# Altium project EPF-100.PrjPcb
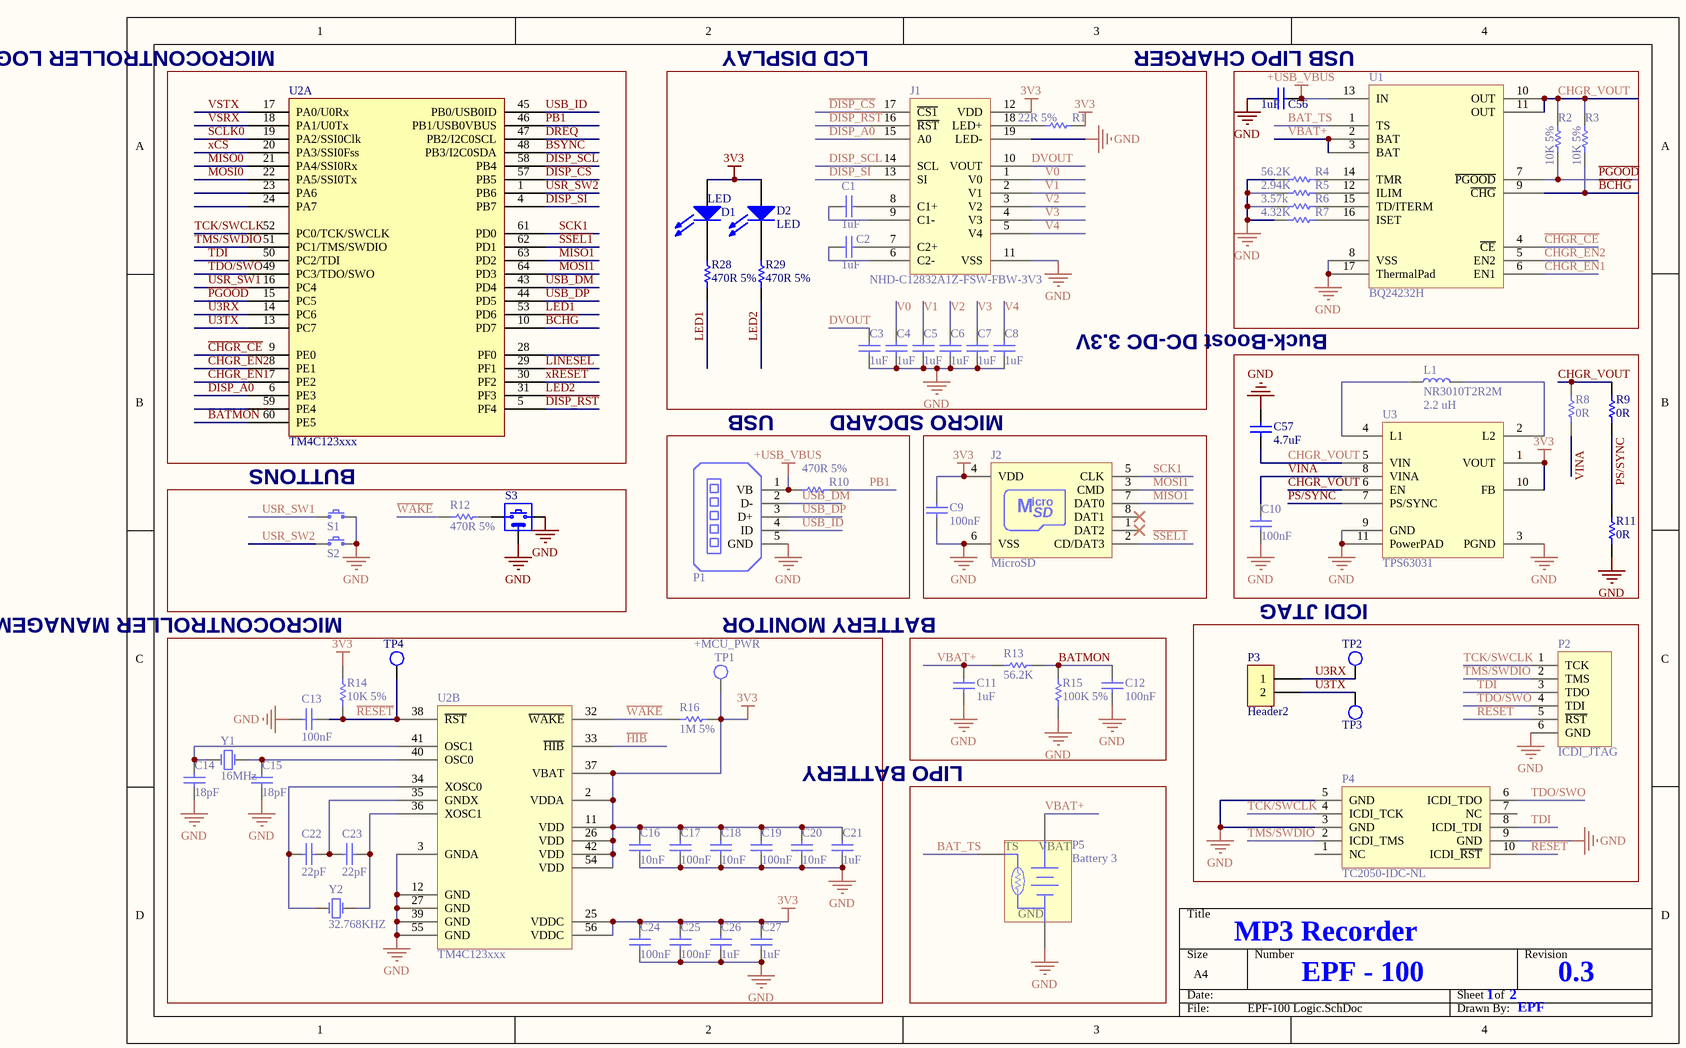
[diagram p0: EPF-100 Logic.SchDoc]
2 sheets, 119 parts. Net scope: global (net labels, ports and power ports of the same name join across sheets).
Board file: EPF-100.PcbDoc
Sheets:
  EPF-100 Logic.SchDoc
  EPF-100 MP3.SchDoc

## Sheet EPF-100 Logic.SchDoc
size A4

### Parts
C1  1uF  [CAP0603]
C2  1uF  [CAP0603]
C3  1uF  [CAP0603]
C4  1uF  [CAP0603]
C5  1uF  [CAP0603]
C6  1uF  [CAP0603]
C7  1uF  [CAP0603]
C8  1uF  [CAP0603]
C9  100nF  [CAP0603]
C10  100nF  [CAP0603]
C11  1uF  [CAP0603]
C12  100nF  [CAP0603]
C13  100nF  [CAP0603]
C14  18pF  [CAP0603]
C15  18pF  [CAP0603]
C16  10nF  [CAP0603]
C17  100nF  [CAP0603]
C18  10nF  [CAP0603]
C19  100nF  [CAP0603]
C20  10nF  [CAP0603]
C21  1uF  [CAP0603]
C22  22pF  [CAP0603]
C23  22pF  [CAP0603]
C24  100nF  [CAP0603]
C25  100nF  [CAP0603]
C26  1uF  [CAP0603]
C27  1uF  [CAP0603]
C56  1uF  [CAP0603]
C57  4.7uF  [CAP0603]
D1  LED  [LED0603]
D2  LED  [LED0603]
J1  NHD-C12832A1Z-FSW-FBW-3V3  [NHD-C12832A1Z]
J2  MicroSD  [ALPS-SCHD1A0101]
L1  NR3010T2R2M  value 2.2 uH  [NR3010]
P1  USB extension  [HDR1X5 - USB]  (value not drawn)
P2  ICDI_JTAG  [HDR1X6]
P3  Header2  [Header2Macho]
P4  TC2050-IDC-NL  [TC2050-IDC-NL]
P5  Battery 3  [HDR1X3]
R1  22R 5%  [RES0603]
R2  10K 5%  [RES0603]
R3  10K 5%  [RES0603]
R4  56.2K  [RES0603]
R5  2.94K  [RES0603]
R6  3.57k  [RES0603]
R7  4.32K  [RES0603]
R8  0R  [RES0603]
R9  0R  [RES0603]
R10  470R 5%  [RES0603]
R11  0R  [RES0603]
R12  470R 5%  [RES0603]
R13  56.2K  [RES0603]
R14  10K 5%  [RES0603]
R15  100K 5%  [RES0603]
R16  1M 5%  [RES0603]
R28  470R 5%  [RES0603]
R29  470R 5%  [RES0603]
S1  switch  [TACTILE SWITCH 3.5x6]  (value not drawn)
S2  switch  [TACTILE SWITCH 3.5x6]  (value not drawn)
S3  switch  [B3U-3100P-B]  (value not drawn)
TP1  +MCU_PWR  [PCB TEST POINT]
TP2  PCB TEST POINT  [PCB TEST POINT]  (value not drawn)
TP3  PCB TEST POINT  [PCB TEST POINT]  (value not drawn)
TP4  PCB TEST POINT  [PCB TEST POINT]  (value not drawn)
U1  BQ24232H  [QFN50P300X300-16V6N]
U2  TM4C123xxx  [LQFP64_N]  (parts A,B of 2)
U3  TPS63031  [SON50P300X300X80-10W2N]
Y1  16MHz  [NX5032GA]
Y2  32.768KHZ  [AB26TRB-32.768KHZ- T]

### Blocks framed on the sheet
BUTTONS: U2
Buck-Boost DC-DC 3.3V: C56 R2-R7 U1
ICDI JTAG: C10 C57 L1 R8 R9 R11 U3
MICROCONTROLLER MANAGEMENT: R12 S1-S3
LIPO BATTERY: C11 C12 R13 R15

### Nets
3V3: C9.2 C16.2 C17.2 C18.2 C19.2 C20.2 C21.2 C24.2 C25.2 C26.2 C27.2 D1.1(A) D2.1(A) J1.12(VDD) J2.4(VDD) R1.1 R14.2 R16.2 TP1.1 U2.2(VDDA) U2.11(VDD) U2.25(VDDC) U2.26(VDD) U2.37(VBAT) U2.42(VDD) U2.54(VDD) U2.56(VDDC) U3.1(VOUT) U3.10(FB)
+USB_VBUS: C56.1 P1.1(VB) R10.1 U1.13(IN)
GND: C3.2 C4.2 C5.2 C6.2 C7.2 C8.2 C9.1 C10.1 C11.1 C12.1 C13.1 C14.2 C15.2 C16.1 C17.1 C18.1 C19.1 C20.1 C21.1 C24.1 C25.1 C26.1 C27.1 C56.2 C57.2 J1.11(VSS) J1.19(LED-) J2.6(VSS) P1.5(GND) P2.6(GND) P4.3(GND) P4.5(GND) P4.9(GND) P5.3(GND) R4.1 R5.1 R6.1 R7.1 R11.1 R15.1 S1.2 S2.2 S3.1 S3.3(GND) U1.8(VSS) U1.17(ThermalPad) U2.3(GNDA) U2.12(GND) U2.27(GND) U2.39(GND) U2.55(GND) U3.3(PGND) U3.9(GND) U3.11(PowerPAD)
~{SSEL1}: J2.2(CD/DAT3) U2.62(PD1)
~{BCHG}: R3.1 U1.9(~{CHG}) U2.10(PD7)
BAT_TS: P5.1(TS) U1.1(TS)
BATMON: C12.2 R13.2 R15.2 U2.60(PE5)
BSYNC: U2.48(PB3/I2C0SDA)
~{CHGR_CE}: U1.4(~{CE}) U2.9(PE0)
CHGR_EN1: U1.6(EN1) U2.7(PE2)
CHGR_EN2: U1.5(EN2) U2.8(PE1)
CHGR_VOUT: C57.1 R2.2 R3.2 R8.1 R9.1 U1.10(OUT) U1.11(OUT) U3.5(VIN) U3.6(EN)
~{DISP_CS}: J1.17(~{CS1}) U2.57(PB5)
~{DISP_RST}: J1.16(~{RST}) U2.5(PF4)
DISP_A0: J1.15(A0) U2.6(PE3)
DISP_SCL: J1.14(SCL) U2.58(PB4)
DISP_SI: J1.13(SI) U2.4(PB7)
DREQ: U2.47(PB2/I2C0SCL)
DVOUT: C3.1 J1.10(VOUT)
~{HIB}: U2.33(~{HIB})
LED1: R28.1 U2.53(PD6)
LED2: R29.1 U2.31(PF3)
LINESEL: U2.29(PF1)
MISO0: U2.21(PA4/SSI0Rx)
MISO1: J2.7(DAT0) U2.63(PD2)
MOSI0: U2.22(PA5/SSI0Tx)
MOSI1: J2.3(CMD) U2.64(PD3)
~{PGOOD}: R2.1 U1.7(~{PGOOD}) U2.15(PC5)
PB1: R10.2 U2.46(PB1/USB0VBUS)
PS/SYNC: R9.2 R11.2 U3.7(PS/SYNC)
~{RESET}: C13.2 P2.5(~{RST}) P4.10(ICDI_~{RST}) R14.1 TP4.1 U2.38(~{RST})
SCK1: J2.5(CLK) U2.61(PD0)
SCLK0: U2.19(PA2/SSI0Clk)
TCK/SWCLK: P2.1(TCK) P4.4(ICDI_TCK) U2.52(PC0/TCK/SWCLK)
TDI: P2.3(TDO) P4.8(ICDI_TDI) U2.50(PC2/TDI)
TDO/SWO: P2.4(TDI) P4.6(ICDI_TDO) U2.49(PC3/TDO/SWO)
TMS/SWDIO: P2.2(TMS) P4.2(ICDI_TMS) U2.51(PC1/TMS/SWDIO)
U3RX: P3.1 TP2.1 U2.14(PC6)
U3TX: P3.2 TP3.1 U2.13(PC7)
USB_DM: P1.2(D-) U2.43(PD4)
USB_DP: P1.3(D+) U2.44(PD5)
USB_ID: P1.4(ID) U2.45(PB0/USB0ID)
USR_SW1: S1.1 U2.16(PC4)
USR_SW2: S2.1 U2.1(PB6)
V0: C4.1 J1.1(V0)
V1: C5.1 J1.2(V1)
V2: C6.1 J1.3(V2)
V3: C7.1 J1.4(V3)
V4: C8.1 J1.5(V4)
VBAT+: C11.2 P5.2(VBAT) R13.1 U1.2(BAT) U1.3(BAT)
VINA: C10.2 R8.2 U3.8(VINA)
VSRX: U2.18(PA1/U0Tx)
VSTX: U2.17(PA0/U0Rx)
~{WAKE}: R12.1 R16.1 U2.32(~{WAKE})
~{xCS}: U2.20(PA3/SSI0Fss)
~{xRESET}: U2.30(PF2)
NetC1_1: C1.1 J1.8(C1+)
NetC1_2: C1.2 J1.9(C1-)
NetC2_1: C2.1 J1.7(C2+)
NetC2_2: C2.2 J1.6(C2-)
NetC14_1: C14.1 U2.41(OSC1) Y1.1(OSC1)
NetC15_1: C15.1 U2.40(OSC0) Y1.2(OSC2)
NetC22_1: C22.1 U2.34(XOSC0) Y2.1(OSC1)
NetC22_2: C22.2 C23.2 U2.35(GNDX)
NetC23_1: C23.1 U2.36(XOSC1) Y2.2(OSC2)
NetD1_2: D1.2(K) R28.2
NetD2_2: D2.2(K) R29.2
NetJ1_18: J1.18(LED+) R1.2
NetL1_1: L1.1 U3.4(L1)
NetL1_2: L1.2 U3.2(L2)
NetR4_2: R4.2 U1.14(TMR)
NetR5_2: R5.2 U1.12(ILIM)
NetR6_2: R6.2 U1.15(TD/ITERM)
NetR7_2: R7.2 U1.16(ISET)
NetR12_2: R12.2 S3.2

Not connected (* = marked no-connect by the designer): J2 1(DAT2)* 8(DAT1)*; P4 1(NC) 7(NC); U2 23(PA6) 24(PA7) 28(PF0) 59(PE4)

### Notes on the sheet
- (near U2) MICROCONTROLLER LOGIC
- (near J1) LCD DISPLAY
- (near U1) USB LIPO CHARGER
- USB
- MICRO SDCARD
- BATTERY MONITOR
- MP3 Recorder
- EPF - 100
- 1
- 2
- 0.3
- EPF
- (in symbol ALPS-SCHD1A0101) icro; M; SD

### Library data of the parts
C1-C8 C11 C21 C26 C27 C56 = CAP 1uF: X7R Ceramic Capacitors - SMD 0603; Manufacturer P/N: C1608X5R1H105KT; Manufacturer: TDK; Value: 1uF 50V; Package: 0603; Price USD (1000pcs): 0.006; Tolerance: X7R
C9 C10 C12 C13 C17 C19 C24 C25 = CAP 100nF: X7R Ceramic Capacitors - SMD 0603; Manufacturer P/N: C1608X7R1H104KT; Manufacturer: TDK; Value: 100nF 50V; Package: 0603; Price USD (1000pcs): 0.007; Tolerance: X7R
C14 C15 = CAP 18pF: C0G Ceramic Capacitors - SMD 0603; Manufacturer P/N: GRM1885C1H180JA01D; Manufacturer: Murata; Value: 18pF 50V; Package: 0603; Tolerance: C0G
C16 C18 C20 = CAP 10nF: X7R Ceramic Capacitors - SMD 0603; Manufacturer P/N: C1608X7R1H103KT; Manufacturer: TDK; Value: 10nF 50V; Package: 0603; Price USD (1000pcs): 0.004; Tolerance: X7R
C22 C23 = CAP 22pF: C0G Ceramic Capacitors - SMD 0603; Manufacturer P/N: CGA3E2C0G1H220J; Manufacturer: TDK; Value: 22pF 50V; Package: 0603; Price USD (1000pcs): 0.011; Tolerance: C0G
C57 = CAP 4.7uF: X7R Ceramic Capacitors - SMD 0603; Manufacturer P/N: GRM188R60J475KE19D; Manufacturer: Murata Electronics; Value: 4.7uF 6.3V; Package: 0603; Price USD (1000pcs): 0.025; Tolerance: X7R
D1 D2 = LED1
J1 = NHD-C12832A1Z-FSW-FBW-3V3: LCD NHD-C12832A1Z-FSW-FBW-3V3
J2 = ALPS-SCHD1A0101: MicroSD Memory Card Connector; Manufacturer: ALPS; Manufacturer P/N: SCHD1A0101
L1 = NR3010T2R2M: Manufacturer: Taiyo Yuden; Manufacturer P/N: NR3010T2R2M; Mouser Part #: 963-NR3010T2R2M
P1 = USB
P2 = ICDI_JTAG: DEBUG ICDI_JTAG
P4 = TC2050-IDC-NL: Manufacturer: Tag-Connect LLC; Manufacturer P/N: TC2050-IDC-NL-430
P5 = Battery 3: Header, 3-Pin; LatestRevisionDate: 17-Jul-2002; LatestRevisionNote: Re-released for DXP Platform.; Publisher: Altium Limited
R1 = RES 22R: 5% Thick Film Resistors - SMD 0603; Manufacturer P/N: CR0603-JW-222ELF; Manufacturer: Bourns; Value: 22R 1/10W; Package: 0603; Price USD (1000pcs): 0.008; Tolerance: 5%
R2 R3 R14 = RES 10K: 5% Thick Film Resistors - SMD 0603; Manufacturer P/N: CR0603-JW-103ELF; Manufacturer: Bourns; Value: 10K 1/10W; Package: 0603; Price USD (1000pcs): 0.008; Tolerance: 5%
R4 R13 = RES 56.2K: 1% Thick Film Resistors - SMD 0603; Manufacturer P/N: ERJ-3EKF5622V; Manufacturer: Panasonic; Tolerance: 5%; Package: 0603; Price USD (1000pcs): 0.008; Value: 56.2K
R5 = RES 2.94K: 1% Thick Film Resistors - SMD 0603; Manufacturer P/N: CRCW06032K94FKEA; Manufacturer: Vishay / Dale; Package: 0603; Price USD (1000pcs): 0.008; Tolerance: 1%; Value: 2.94K
R6 = RES 3.57k: 1% Thick Film Resistors - SMD 0603; Manufacturer P/N: ERJ-3EKF3571V; Manufacturer: Panasonic; Package: 0603; Price USD (1000pcs): 0.003; Tolerance: 1%; Value: 3.57k
R7 = RES 4.32K: 1% Thick Film Resistors - SMD 0603; Manufacturer P/N: ERJ-3EKF4321V; Manufacturer: Panasonic; Package: 0603; Price USD (1000pcs): 0.008; Tolerance: 1%; Value: 4.32K
R8 R9 R11 = RES 0R: 5% Thick Film Resistors - SMD 0603; Manufacturer P/N: RK73H1JTTD1002F; Manufacturer: KOA Speer; Package: 0603; Price USD (1000pcs): 0.008; Tolerance: 5%; Value: 0R
R10 R12 R28 R29 = RES 470R: 5% Thick Film Resistors - SMD 0603; Manufacturer P/N: CR0603-JW-471ELF; Manufacturer: Bourns; Value: 470R 1/10W; Package: 0603; Price USD (1000pcs): 0.01; Tolerance: 5%
R15 = RES 100K: 5% Thick Film Resistors - SMD 0603; Manufacturer P/N: CR0603-JW-104ELF; Manufacturer: Bourns; Value: 100K 1/10W; Package: 0603; Price USD (1000pcs): 0.01; Tolerance: 5%
R16 = RES 1M: 5% Thick Film Resistors - SMD 0603; Manufacturer P/N: CR0603-JW-105ELF; Manufacturer: Bourns; Value: 1M 1/10W; Package: 0603; Price USD (1000pcs): 0.01; Tolerance: 5%
S1 S2 = SW-PB: TACTILE SWITCH 3.5x6; Value: *
S3 = B3U-3100P-B: Manufacturer: Omron; Manufacturer P/N: B3U-3100P-B; digikey P/N: SW1103CT-ND
TP1 = PCB TEST POINT
U1 = BQ24232H: USB-Friendly Lithium-Ion Battery Charger and Power-Path Management IC; Manufacturer: Ti; Manufacturer P/N: BQ24232H; Package: QFN-16
U2 = TM4C123: Manufacturer: Ti; Manufacturer P/N: TM4C123
U3 = TPS63031: HIGH EFFICIENCY SINGLE INDUCTOR BUCK-BOOST CONVERTER WITH 1-A SWITCHES; Manufacturer: Ti; Manufacturer P/N: TPS63031
Y1 = XTAL 16MHz: Crystal, 16.00 MHz 5.0x3.2mm SMT; Manufacturer: NDK; Manufacturer P/N: NX5032GA-16.000000 MHz; Manufacturer 2 P/N: ABM3-16.000 MHz-B2- T; Manufacturer 2: Abracon
Y2 = XTAL 32.768KHZ: Crystal, 32.768 kHz Radial Can; Manufacturer: Abracon; Manufacturer P/N: AB26TRB-32.768KHZ- T

## Sheet EPF-100 MP3.SchDoc
size A4
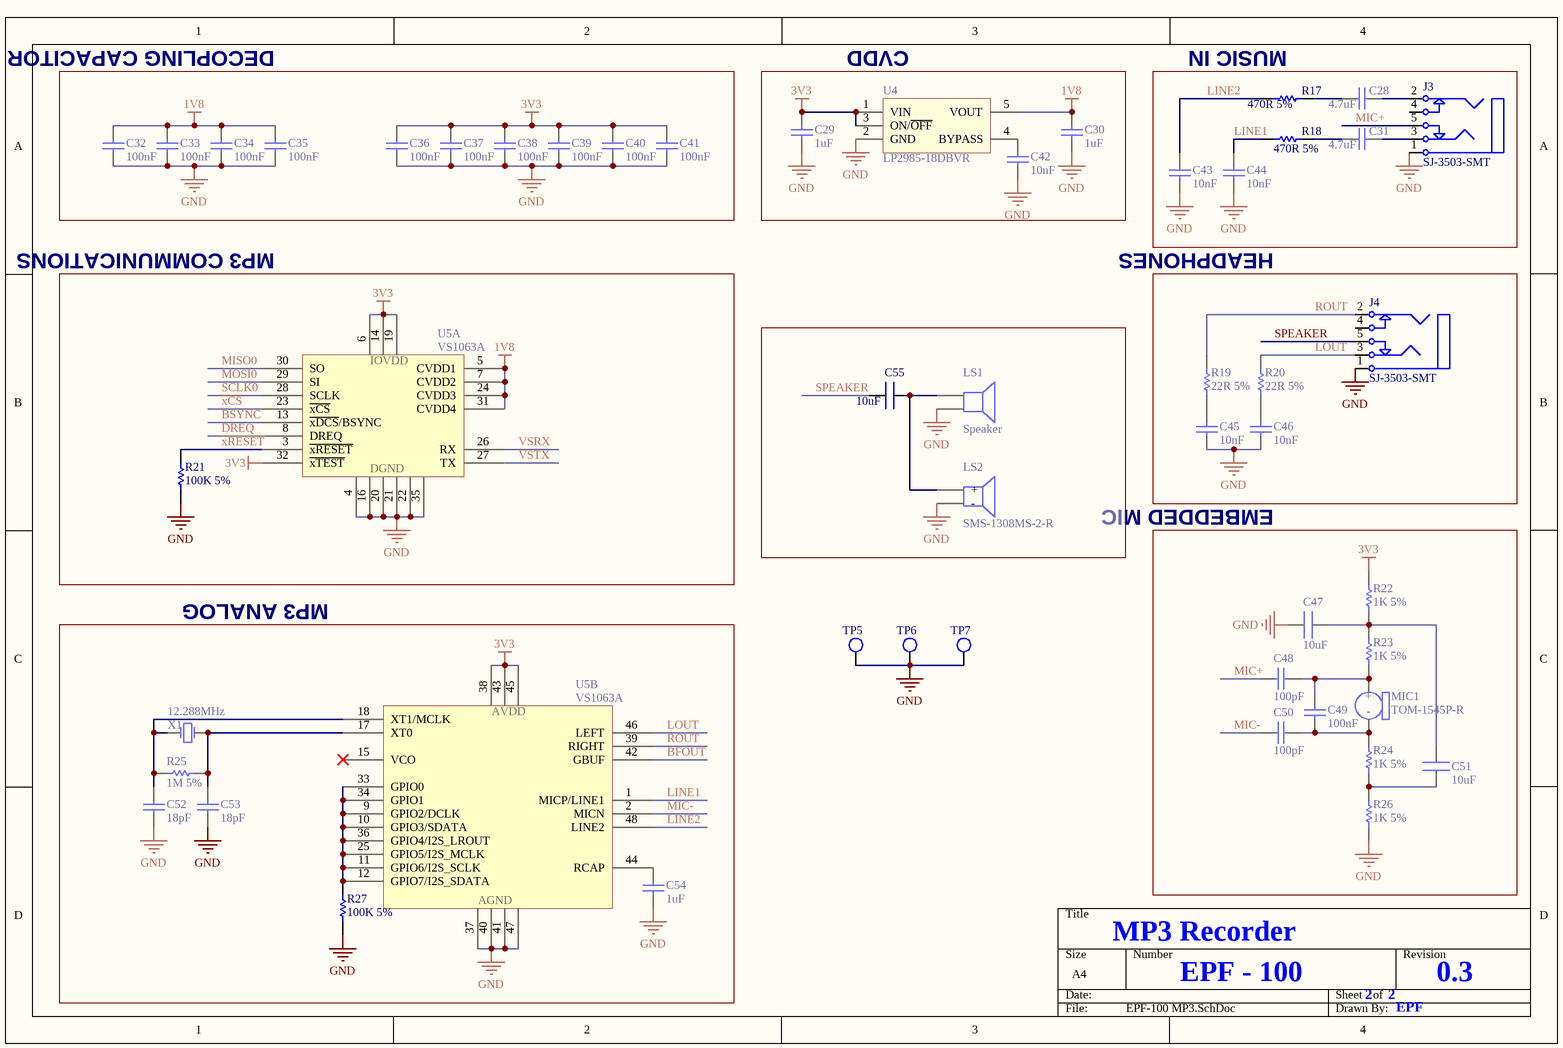
[diagram p1: EPF-100 MP3.SchDoc]

### Parts
C28  4.7uF  [CAP0603]
C29  1uF  [CAP0603]
C30  1uF  [CAP0603]
C31  4.7uF  [CAP0603]
C32  100nF  [CAP0603]
C33  100nF  [CAP0603]
C34  100nF  [CAP0603]
C35  100nF  [CAP0603]
C36  100nF  [CAP0603]
C37  100nF  [CAP0603]
C38  100nF  [CAP0603]
C39  100nF  [CAP0603]
C40  100nF  [CAP0603]
C41  100nF  [CAP0603]
C42  10nF  [CAP0603]
C43  10nF  [CAP0603]
C44  10nF  [CAP0603]
C45  10nF  [CAP0603]
C46  10nF  [CAP0603]
C47  10uF  [CAP0805]
C48  100pF  [CAP0603]
C49  100nF  [CAP0603]
C50  100pF  [CAP0603]
C51  10uF  [CAP0805]
C52  18pF  [CAP0603]
C53  18pF  [CAP0603]
C54  1uF  [CAP0603]
C55  10uF  [CAP0805]
J3  SJ-3503-SMT  [SJ-3503-SMT]
J4  SJ-3503-SMT  [SJ-3503-SMT]
LS1  Speaker  [HDR1X2 - Speaker]
LS2  SMS-1308MS-2-R  [SMS-1308MS-2-R]
MIC1  TOM-1545P-R  [TOM-154P-R]
R17  470R 5%  [RES0603]
R18  470R 5%  [RES0603]
R19  22R 5%  [RES0603]
R20  22R 5%  [RES0603]
R21  100K 5%  [RES0603]
R22  1K 5%  [RES0603]
R23  1K 5%  [RES0603]
R24  1K 5%  [RES0603]
R25  1M 5%  [RES0603]
R26  1K 5%  [RES0603]
R27  100K 5%  [RES0603]
TP5  PCB TEST POINT  [PCB TEST POINT]  (value not drawn)
TP6  PCB TEST POINT  [PCB TEST POINT]  (value not drawn)
TP7  PCB TEST POINT  [PCB TEST POINT]  (value not drawn)
U4  LP2985-18DBVR  [SOT23-5BN]
U5  VS1063A  [TQFP48_N - VLSI]  (parts A,B of 2)
X1  12.288MHz  [SMD XTAL ABM3B]

### Blocks framed on the sheet
HEADPHONES: C28 C31 C43 C44 J3 R17 R18
EMBEDDED MIC: C45 C46 J4 R19 R20

### Nets
1V8: C30.2 C32.2 C33.2 C34.2 C35.2 U4.5(VOUT) U5.5(CVDD1) U5.7(CVDD2) U5.24(CVDD3) U5.31(CVDD4)
3V3: C29.2 C36.2 C37.2 C38.2 C39.2 C40.2 C41.2 R22.2 U4.1(VIN) U4.3(ON/~{OFF}) U5.6(IOVDD1) U5.14(IOVDD2) U5.19(IOVDD3) U5.32(~{xTEST}) U5.38(AVDD1) U5.43(AVDD2) U5.45(AVDD3)
GND: C29.1 C30.1 C32.1 C33.1 C34.1 C35.1 C36.1 C37.1 C38.1 C39.1 C40.1 C41.1 C42.1 C43.1 C44.1 C45.2 C46.2 C47.2 C52.2 C53.2 C54.1 J3.1 J4.1 LS1.2 LS2.2(-) R21.1 R26.1 R27.1 TP5.1 TP6.1 TP7.1 U4.2(GND) U5.4(DGND1) U5.16(DGND2) U5.20(DGND3) U5.21(DGND4) U5.22(DGND5) U5.35(DGND6) U5.37(AGND1) U5.40(AGND2) U5.41(AGND3) U5.47(AGND4)
BFOUT: U5.42(GBUF)
BSYNC: U5.13(~{xDCS}/BSYNC)
DREQ: U5.8(DREQ)
LINE1: C44.2 R18.1 U5.1(MICP/LINE1)
LINE2: C43.2 R17.1 U5.48(LINE2)
LOUT: J4.3 R20.1 U5.46(LEFT)
MIC+: C48.2 J3.5
MIC-: C50.2 U5.2(MICN)
MISO0: U5.30(SO)
MOSI0: U5.29(SI)
ROUT: J4.2 R19.1 U5.39(RIGHT)
SCLK0: U5.28(SCLK)
SPEAKER: C55.1 J4.5
VSRX: U5.26(RX)
VSTX: U5.27(TX)
~{xCS}: U5.23(~{xCS})
~{xRESET}: R21.2 U5.3(~{xRESET})
NetC28_1: C28.1 J3.2
NetC28_2: C28.2 R17.2
NetC31_1: C31.1 J3.3
NetC31_2: C31.2 R18.2
NetC42_2: C42.2 U4.4(BYPASS)
NetC45_1: C45.1 R19.2
NetC46_1: C46.1 R20.2
NetC47_1: C47.1 C51.1 R22.1 R23.2
NetC48_1: C48.1 C49.2 MIC1.1(Term_+) R23.1
NetC49_1: C49.1 C50.1 MIC1.2(Term_-) R24.2
NetC51_2: C51.2 R24.1 R26.2
NetC52_1: C52.1 R25.2 U5.18(XT1/MCLK) X1.3
NetC53_1: C53.1 R25.1 U5.17(XT0) X1.1
NetC54_2: C54.2 U5.44(RCAP)
NetC55_2: C55.2 LS1.1 LS2.1(+)
NetR27_2: R27.2 U5.9(GPIO2/DCLK) U5.10(GPIO3/SDATA) U5.11(GPIO6/I2S_SCLK) U5.12(GPIO7/I2S_SDATA) U5.25(GPIO5/I2S_MCLK) U5.33(GPIO0) U5.34(GPIO1) U5.36(GPIO4/I2S_LROUT)

Not connected (* = marked no-connect by the designer): J3 4; J4 4; U5 15(VCO)*

### Notes on the sheet
- DECOPLING CAPACITOR
- (near U4) CVDD
- MUSIC IN
- MP3 COMMUNICATIONS
- MP3 ANALOG
- MP3 Recorder
- EPF - 100
- 2
- 0.3
- EPF
- (in symbol PTH ELECTRET MIC) +; -
- (in symbol VS1063A, part A) IOVDD; DGND
- (in symbol VS1063A, part B) AVDD; AGND

### Library data of the parts
C28 C31 = CAP 4.7uF: as C57 on sheet EPF-100 Logic; Package: 0603; Price USD (1000pcs): 0.025; Tolerance: X7R
C29 C30 C54 = CAP 1uF: as C1 on sheet EPF-100 Logic; Package: 0603; Price USD (1000pcs): 0.006; Tolerance: X7R
C32-C41 C49 = CAP 100nF: as C9 on sheet EPF-100 Logic; Package: 0603; Price USD (1000pcs): 0.007; Tolerance: X7R
C42-C46 = CAP 10nF: as C16 on sheet EPF-100 Logic; Package: 0603; Price USD (1000pcs): 0.004; Tolerance: X7R
C47 C51 C55 = CAP CER 0805 X5R 10uF 35V: X5R Ceramic Capacitors - SMD 0805; Package: 0805; Tolerance: X5R; Value: 10uF 35V
C48 C50 = CAP 100pF: C0G Ceramic Capacitors - SMD 0603; Manufacturer P/N: C1608C0G1H101JT; Manufacturer: TDK; Value: 100pF 50V; Package: 0603; Price USD (1000pcs): 0.007; Tolerance: C0G
C52 C53 = CAP 18pF: as C14 on sheet EPF-100 Logic; Package: 0603; Tolerance: C0G
J3 J4 = SJ-3503-SMT: 3-Conductor Jack with 2 break contacts (normals) and 2 auxiliary make contacts
LS1 = Speaker: Loudspeaker
LS2 = SMS-1308MS-2-R: Loudspeaker; Manufacturer: PUI Audio; Manufacturer P/N: SMS-1308MS-2-R
MIC1 = PTH ELECTRET MIC
R17 R18 = RES 470R: as R10 on sheet EPF-100 Logic; Package: 0603; Price USD (1000pcs): 0.01; Tolerance: 5%
R19 R20 = RES 22R: as R1 on sheet EPF-100 Logic; Package: 0603; Price USD (1000pcs): 0.008; Tolerance: 5%
R21 R27 = RES 100K: as R15 on sheet EPF-100 Logic; Package: 0603; Price USD (1000pcs): 0.01; Tolerance: 5%
R22-R24 R26 = RES 1K: 5% Thick Film Resistors - SMD 0603; Manufacturer P/N: CR0603-JW-102ELF; Manufacturer: Bourns; Value: 1K 1/10W; Package: 0603; Price USD (1000pcs): 0.008; Tolerance: 5%
R25 = RES 1M: as R16 on sheet EPF-100 Logic; Package: 0603; Price USD (1000pcs): 0.01; Tolerance: 5%
U4 = LP2985: 1.8V Current 150mA; Manufacturer: Texas Instruments; Manufacturer P/N: LP2985-18DBVR
U5 = VS1063A: MP3 Encoder/Decoder; Package: LQFP-48; Manufacturer P/N: VS1063A
X1 = SMD XTAL 12.288MHz ABM3B: CERAMIC SURFACE MOUNT MICROPROCESSOR CRYSTAL; Manufacturer P/N: ABM3B-12.288MHZ-B2-T; Manufacturer: ABRACON

## Nets that join several sheets
3V3: EPF-100 Logic (29 pins), EPF-100 MP3 (17 pins)
GND: EPF-100 Logic (54 pins), EPF-100 MP3 (42 pins)
BSYNC: EPF-100 Logic (U2.48), EPF-100 MP3 (U5.13)
DREQ: EPF-100 Logic (U2.47), EPF-100 MP3 (U5.8)
MISO0: EPF-100 Logic (U2.21), EPF-100 MP3 (U5.30)
MOSI0: EPF-100 Logic (U2.22), EPF-100 MP3 (U5.29)
SCLK0: EPF-100 Logic (U2.19), EPF-100 MP3 (U5.28)
VSRX: EPF-100 Logic (U2.18), EPF-100 MP3 (U5.26)
VSTX: EPF-100 Logic (U2.17), EPF-100 MP3 (U5.27)
~{xCS}: EPF-100 Logic (U2.20), EPF-100 MP3 (U5.23)
~{xRESET}: EPF-100 Logic (U2.30), EPF-100 MP3 (R21.2 U5.3)